# EAGLE design FabDisPendant (EAGLE 7.4.0)
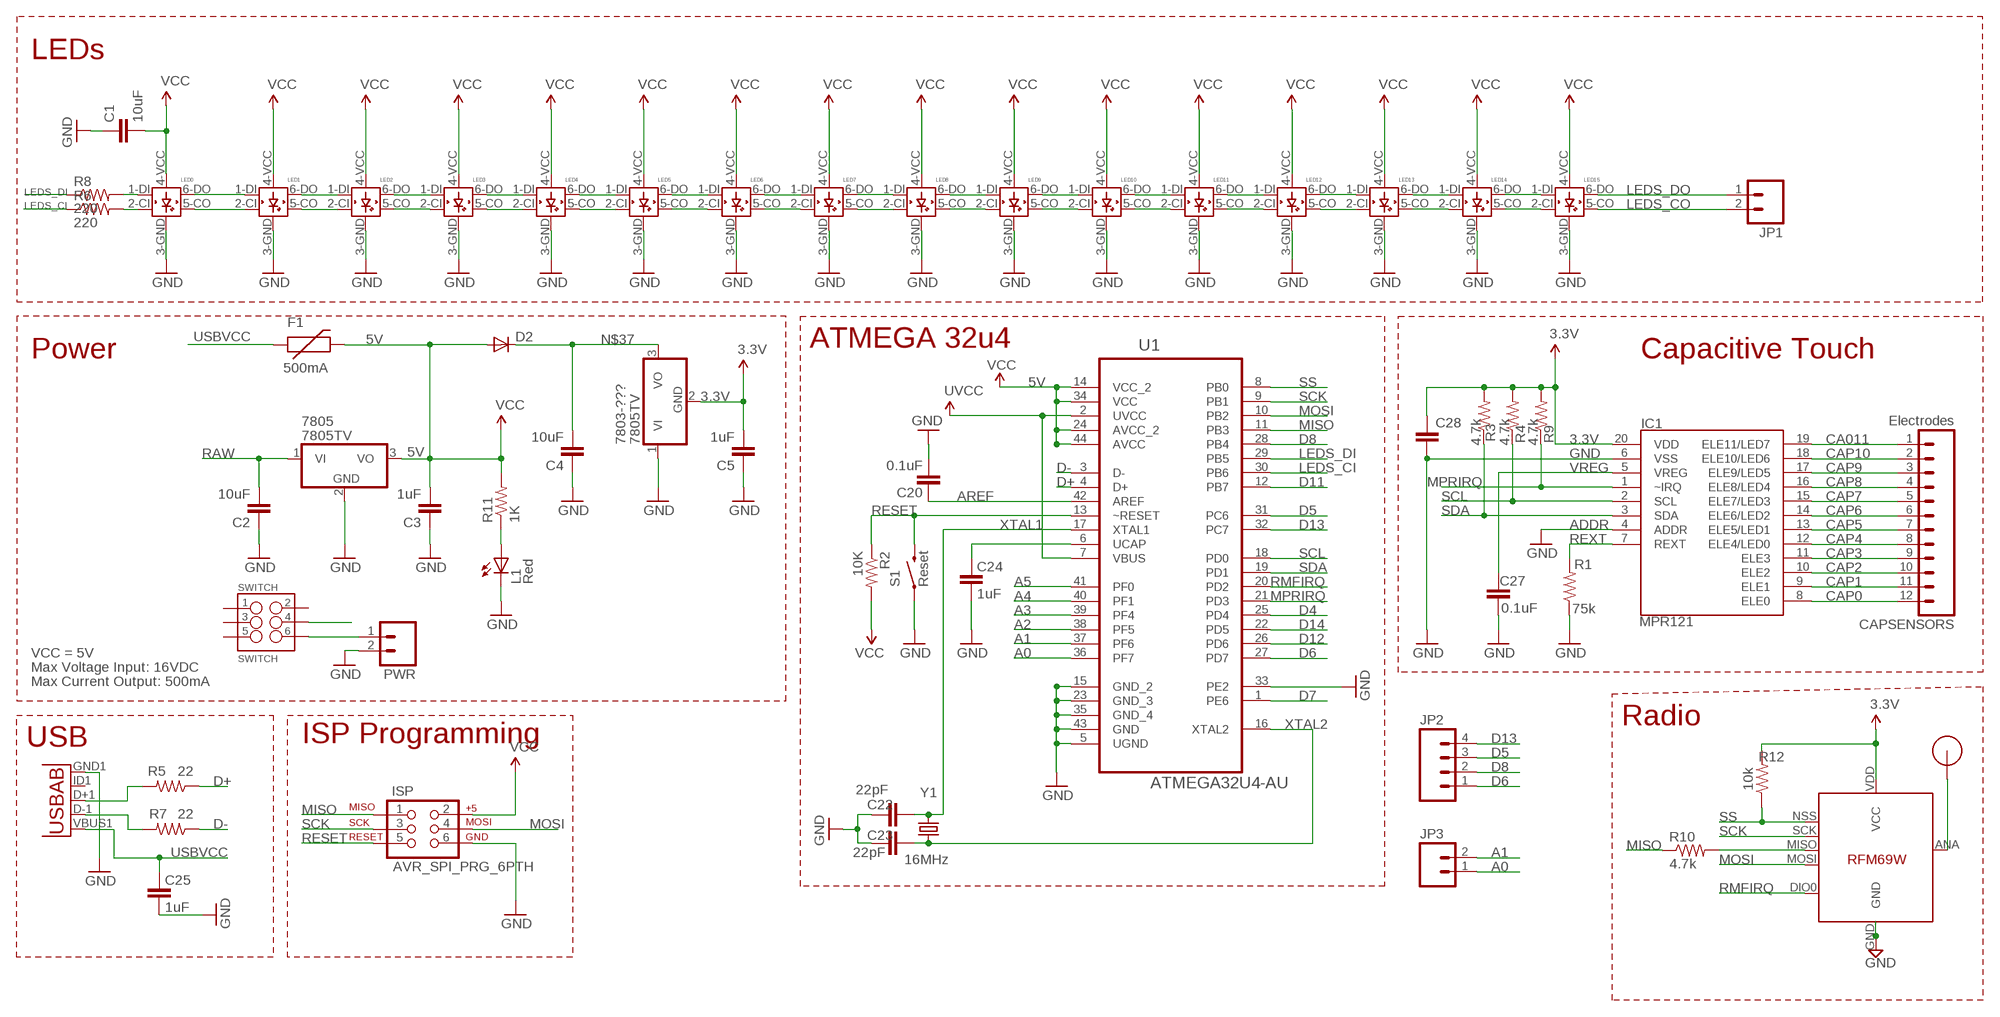
[diagram p0: schematic, sheet 1]

## Parts
7803-???  7805TV  [TO220V]
7805  7805TV  [TO220V]
C1  10uF  10UF-6.3V-20%(1206)  [1206]
C2  10uF  10UF-6.3V-20%(1206)  [1206]
C3  1uF  10UF-6.3V-20%(1206)  [1206]
C4  10uF  10UF-6.3V-20%(1206)  [1206]
C5  1uF  10UF-6.3V-20%(1206)  [1206]
C20  0.1uF  CAP0603-CAP  [0603-CAP]
C22  22pF  CAP0603-CAP  [0603-CAP]
C23  22pF  CAP0603-CAP  [0603-CAP]
C24  1uF  CAP0603-CAP  [0603-CAP]
C25  1uF  CAP0603-CAP  [0603-CAP]
C27  0.1uF  CAP0603-CAP  [0603-CAP]
C28  0.1uF  CAP0603-CAP  [0603-CAP]
CAPSENSORS  Electrodes  M12PTH  [1X12]
D2  DIODESOD  [SOD-323]
F1  500mA  PTCSMD  [PTC-1206]
IC1  MPR121  MPR121V2  [QFN-20-0.4MM-V2]
ISP  AVR_SPI_PRG_6PTH  [2X3]
JP1  M02PTH  [1X02]
JP2  M04PTH  [1X04]
JP3  M02PTH  [1X02]
L1  Red  LED0603  [LED-0603]
LED0  APA102  [5050]
LED1  APA102  [5050]
LED2  APA102  [5050]
LED3  APA102  [5050]
LED4  APA102  [5050]
LED5  APA102  [5050]
LED6  APA102  [5050]
LED7  APA102  [5050]
LED8  APA102  [5050]
LED9  APA102  [5050]
LED10  APA102  [5050]
LED11  APA102  [5050]
LED12  APA102  [5050]
LED13  APA102  [5050]
LED14  APA102  [5050]
LED15  APA102  [5050]
PWR  M025MM  [SCREWTERMINAL-5MM-2]
R1  75k  RESISTOR0603-RES  [0603-RES]
R2  10K  RESISTOR0603-RES  [0603-RES]
R3  4.7k  RESISTOR0603-RES  [0603-RES]
R4  4.7k  RESISTOR0603-RES  [0603-RES]
R5  22  RESISTOR0603-RES  [0603-RES]
R6  220  220OHM-1/10W-1%(0603)  [0603-RES@1]
R7  22  RESISTOR0603-RES  [0603-RES]
R8  220  220OHM-1/10W-1%(0603)  [0603-RES@1]
R9  4.7k  RESISTOR0603-RES  [0603-RES]
R10  4.7k  RESISTOR0603-RES  [0603-RES]
R11  1K  RESISTOR0603-RES  [0603-RES]
R12  10k  RESISTOR0603-RES  [0603-RES]
RMF69  RFM69  [RFM69W-MINPADS]
S1  Reset  SWITCH-MOMENTARY-2SMD  [TACTILE_SWITCH_SMD]
SWITCH  SWITCH  M03X2FEMALE  [2X3]
U1  ATMEGA32U4-AU  [QFP80P1200X1200X120-44N]
U$1  RFM12B_ANTENNA  [RFM12B-ANTENNA]
X2  USB-ABIN&OUT  [USB-AB-MICRO-SMD-V03-IN&OUT]
Y1  16MHz  CRYSTAL5X3  [CRYSTAL-SMD-5X3]

## Nets
3.3V: 7803-???.2(GND) C5.2 C28.1 IC1.20(VDD) R3.2 R4.2 R9.2 R12.2 RMF69.VDD(VCC)
5V: 7805.3(VO) C1.2 C3.2 D2.2(A) F1.2 ISP.2 LED0.4-VCC(VCC) R2.2 R11.2 U1.14(VCC_2) U1.24(AVCC_2) U1.34(VCC) U1.44(AVCC) ; supply symbol labelled VCC
.: R10.2 RMF69.MISO
A0: JP3.1 U1.36(PF7)
A1: JP3.2 U1.37(PF6)
A2: U1.38(PF5)
A3: U1.39(PF4)
A4: U1.40(PF1)
A5: U1.41(PF0)
ADDR: IC1.4(ADDR) ; supply symbol labelled GND
AREF: C20.2 U1.42(AREF)
CA011: CAPSENSORS.1 IC1.19(ELE11/LED7)
CAP0: CAPSENSORS.12 IC1.8(ELE0)
CAP1: CAPSENSORS.11 IC1.9(ELE1)
CAP2: CAPSENSORS.10 IC1.10(ELE2)
CAP3: CAPSENSORS.9 IC1.11(ELE3)
CAP4: CAPSENSORS.8 IC1.12(ELE4/LED0)
CAP5: CAPSENSORS.7 IC1.13(ELE5/LED1)
CAP6: CAPSENSORS.6 IC1.14(ELE6/LED2)
CAP7: CAPSENSORS.5 IC1.15(ELE7/LED3)
CAP8: CAPSENSORS.4 IC1.16(ELE8/LED4)
CAP9: CAPSENSORS.3 IC1.17(ELE9/LED5)
CAP10: CAPSENSORS.2 IC1.18(ELE10/LED6)
D4: U1.25(PD4)
D5: JP2.3 U1.31(PC6)
D6: JP2.1 U1.27(PD7)
D7: U1.1(PE6)
D8: JP2.2 U1.28(PB4)
D11: U1.12(PB7)
D12: U1.26(PD6)
D13: JP2.4 U1.32(PC7)
D14: U1.22(PD5)
D+: R5.1 U1.4(D+)
D-: R7.1 U1.3(D-)
GND: 7803-???.1(VI) 7805.2(GND) C1.1 C2.1 C3.1 C4.1 C5.1 C20.1 C22.2 C23.2 C24.1 C25.1 C27.2 C28.2 IC1.6(VSS) ISP.6 L1.C LED0.3-GND(GND) LED1.3-GND(GND) LED2.3-GND(GND) LED3.3-GND(GND) LED4.3-GND(GND) LED5.3-GND(GND) LED6.3-GND(GND) LED7.3-GND(GND) LED8.3-GND(GND) LED9.3-GND(GND) LED10.3-GND(GND) LED11.3-GND(GND) LED12.3-GND(GND) LED13.3-GND(GND) LED14.3-GND(GND) LED15.3-GND(GND) PWR.2 R1.1 RMF69.GND S1.1 U1.5(UGND) U1.15(GND_2) U1.23(GND_3) U1.33(PE2) U1.35(GND_4) U1.43(GND) X2.GND1(GND)
LEDS_CI: R6.1 U1.30(PB6)
LEDS_CO: JP1.2 LED15.5-CO(CO)
LEDS_DI: R8.1 U1.29(PB5)
LEDS_DO: JP1.1 LED15.6-DO(DO)
MISO: ISP.1 R10.1 U1.11(PB3)
MOSI: ISP.4 RMF69.MOSI U1.10(PB2)
MPRIRQ: IC1.1(~IRQ) R9.1 U1.21(PD3)
N$1: LED0.1-DI(DI) R8.2
N$2: LED0.6-DO(DO) LED1.1-DI(DI)
N$3: LED0.2-CI(CI) R6.2
N$4: LED0.5-CO(CO) LED1.2-CI(CI)
N$5: LED1.6-DO(DO) LED2.1-DI(DI)
N$6: LED1.5-CO(CO) LED2.2-CI(CI)
N$7: LED2.6-DO(DO) LED3.1-DI(DI)
N$8: LED2.5-CO(CO) LED3.2-CI(CI)
N$9: LED3.5-CO(CO) LED4.2-CI(CI)
N$10: LED3.6-DO(DO) LED4.1-DI(DI)
N$11: LED4.6-DO(DO) LED5.1-DI(DI)
N$12: LED4.5-CO(CO) LED5.2-CI(CI)
N$13: LED5.6-DO(DO) LED6.1-DI(DI)
N$14: LED5.5-CO(CO) LED6.2-CI(CI)
N$15: LED6.6-DO(DO) LED7.1-DI(DI)
N$16: LED6.5-CO(CO) LED7.2-CI(CI)
N$17: LED7.5-CO(CO) LED8.2-CI(CI)
N$18: LED7.6-DO(DO) LED8.1-DI(DI)
N$19: LED8.6-DO(DO) LED9.1-DI(DI)
N$20: R7.2 X2.D-1(D-)
N$21: R5.2 X2.D+1(D+)
N$22: LED8.5-CO(CO) LED9.2-CI(CI)
N$23: LED9.6-DO(DO) LED10.1-DI(DI)
N$24: LED9.5-CO(CO) LED10.2-CI(CI)
N$25: RMF69.ANA(ANT) U$1.P$1
N$26: LED10.6-DO(DO) LED11.1-DI(DI)
N$27: LED10.5-CO(CO) LED11.2-CI(CI)
N$28: LED11.6-DO(DO) LED12.1-DI(DI)
N$29: LED11.5-CO(CO) LED12.2-CI(CI)
N$30: LED12.6-DO(DO) LED13.1-DI(DI)
N$31: LED12.5-CO(CO) LED13.2-CI(CI)
N$32: LED13.6-DO(DO) LED14.1-DI(DI)
N$33: LED13.5-CO(CO) LED14.2-CI(CI)
N$34: LED14.6-DO(DO) LED15.1-DI(DI)
N$35: LED14.5-CO(CO) LED15.2-CI(CI)
N$36: PWR.1 SWITCH.6
N$37: 7803-???.3(VO) C4.2 D2.1(C)
N$38: L1.A R11.1
N$55: C24.2 U1.6(UCAP)
RAW [vcc]: 7805.1(VI) C2.2 SWITCH.4
RESET: ISP.5 R2.1 S1.3 U1.13(~RESET)
REXT: IC1.7(REXT) R1.2
RMFIRQ: RMF69.DIO0 U1.20(PD2)
SCK: ISP.3 RMF69.SCK U1.9(PB1)
SCL: IC1.2(SCL) R4.1 U1.18(PD0)
SDA: IC1.3(SDA) R3.1 U1.19(PD1)
SS: R12.1 RMF69.NSS(SEL) U1.8(PB0)
USBVCC: C25.2 F1.1 U1.2(UVCC) U1.7(VBUS) X2.VBUS1(VBUS) ; supply symbol labelled UVCC
VCC: LED1.4-VCC(VCC) LED2.4-VCC(VCC) LED3.4-VCC(VCC) LED4.4-VCC(VCC) LED5.4-VCC(VCC) LED6.4-VCC(VCC) LED7.4-VCC(VCC) LED8.4-VCC(VCC) LED9.4-VCC(VCC) LED10.4-VCC(VCC) LED11.4-VCC(VCC) LED12.4-VCC(VCC) LED13.4-VCC(VCC) LED14.4-VCC(VCC) LED15.4-VCC(VCC)
VREG: C27.1 IC1.5(VREG)
XTAL1: C22.1 U1.17(XTAL1) Y1.3
XTAL2: C23.1 U1.16(XTAL2) Y1.1
Unconnected: SWITCH.1 SWITCH.2 SWITCH.3 SWITCH.5 X2.ID1(USBID)

## Notes on the sheet
- LEDs
- ATMEGA 32u4
- Power | Capacitive Touch
- VCC = 5V
- Max Voltage Input: 16VDC
- Max Current Output: 500mA
- Radio
- USB | ISP Programming

## Library data of the parts
7803-??? 7805 = linear:78*: Positive VOLTAGE REGULATOR Source: http://cache.national.com/ds/LM/LM78L05.pdf http://www.fairchildsemi.com/ds/LM/LM7805.pdf
C1 C2 C4 = SparkFun-Capacitors:10UF-6.3V-20%(1206): CAP-10057 Ceramic; PROD_ID: CAP-10057
C3 C5 = SparkFun-Capacitors:10UF-6.3V-20%(1206): CAP-10057 Ceramic; PROD_ID: CAP-10057; VALUE: 10uF
C20 C22-C25 C27 C28 = SparkFun:CAP: Capacitor Standard 0603 ceramic capacitor, and 0.1" leaded capacitor.
CAPSENSORS = SparkFun:M12: Header 12 Standard 12-pin 0.1" header. Use with straight break away headers (SKU : PRT-00116), right angle break away headers (PRT-00553), swiss pins (PRT-00743), machine pins (PRT-00117), and female headers (PRT-00115).
D2 = SparkFun:DIODE: Diode These are standard reverse protection diodes and small signal diodes. SMA package can handle up to about 1A. SOD-323 can handle about 200mA. What the SOD-323 package when ordering, there are some mfgs out there that are 5-pin packages.
F1 = SparkFun:PTC: Resettable Fuse PTC Resettable Fuse. Spark Fun Electronics SKU : COM-08357
IC1 = Testing:MPR121: MPR121 Capacitive Touch Sensor Controller. Variant "V2" was created using an image import of the bottom of the IC. It matches metal to metal.
ISP = SparkFun-Connectors:AVR_SPI_PRG_6: AVR ISP 6 Pin This is the reduced ISP connector for AVR programming. Common on Arduino. This footprint will take up less PCB space and can be used with a 10-pin to 6-pin adapter such as SKU: BOB-08508
JP1 JP3 = SparkFun-Connectors:M02: Standard 2-pin 0.1" header. Use with - straight break away headers ( PRT-00116) - right angle break away headers (PRT-00553) - swiss pins (PRT-00743) - machine pins (PRT-00117) - female headers (PRT-00115) Molex polarized connector foot print use with: PRT-08233 with associated crimp pins and housings. 2.54_SCREWTERM for use with PRT-10571. 3.5mm Screw Terminal footprints for PRT-08084 5mm Screw Terminal footprints for use with PRT-08432
JP2 = SparkFun-Connectors:M04: Header 4 Standard 4-pin 0.1" header. Use with straight break away headers (SKU : PRT-00116), right angle break away headers (PRT-00553), swiss pins (PRT-00743), machine pins (PRT-00117), and female headers (PRT-00115). Molex polarized connector foot print use with SKU : PRT-08231 with associated crimp pins and housings. 1MM SMD Version SKU: PRT-10208
L1 = SparkFun:LED: LEDs Standard schematic elements and footprints for 5mm, 3mm, 1206, and 0603 sized LEDs. 5mm - Spark Fun Electronics SKU : COM-00529 (and others)
LED0 LED1-LED15 = APA102:APA102: APA102C LED Specsheet <https://cdn-shop.adafruit.com/datasheets/APA102.pdf> Blog post <https://cpldcpu.wordpress.com/2014/08/27/apa102/> Adafruit <https://www.adafruit.com/products/2343>
PWR = SparkFun-Connectors:M02: Standard 2-pin 0.1" header. Use with - straight break away headers ( PRT-00116) - right angle break away headers (PRT-00553) - swiss pins (PRT-00743) - machine pins (PRT-00117) - female headers (PRT-00115) Molex polarized connector foot print use with: PRT-08233 with associated crimp pins and housings. 2.54_SCREWTERM for use with PRT-10571. 3.5mm Screw Terminal footprints for PRT-08084 5mm Screw Terminal footprints for use with PRT-08432; STOREFRONT_ID: PRT-08432
R1-R5 R7 R9-R12 = SparkFun:RESISTOR: Resistor Basic schematic elements and footprints for 0603, 1206, and PTH 1/10th watt (small) resistors.
R6 R8 = SparkFun-Resistors:220OHM-1/10W-1%(0603): RES-07861; PROD_ID: RES-07861
RMF69 = LowPowerLab:RFM69
S1 = SparkFun:SWITCH-MOMENTARY-2
SWITCH = SparkFun-Connectors:M03X2: 2x3 .1" header. Shrouded, with keying- CONN-10681 SMT- CONN-11415 Pogo pins- HW-11044; PROD_ID: CONN-11566; VALUE: FEMALE 2x3
U1 = Atmel_By_element14_Batch_1-00:ATMEGA32U4-AU: 8-bit Microcontroller with ISP Flash and USB Controller; MPN: ATMEGA32U4-AU; OC_FARNELL: 1748525; OC_NEWARK: 26R5633; PACKAGE: TQFP-44; SUPPLIER: Atmel
U$1 = LowPowerLab:RFM12B_ANTENNA
X2 = Testing:USB-AB: This is a USB AB connector that is compatible with USB OTG. i.e. this connector can serve as a host or device
Y1 = SparkFun:CRYSTAL: Crystals Various standard crystals. Proven footprints. Spark Fun Electronics SKU : COM-00534

## Net classes
0 default: width 0.203 mm

## Board
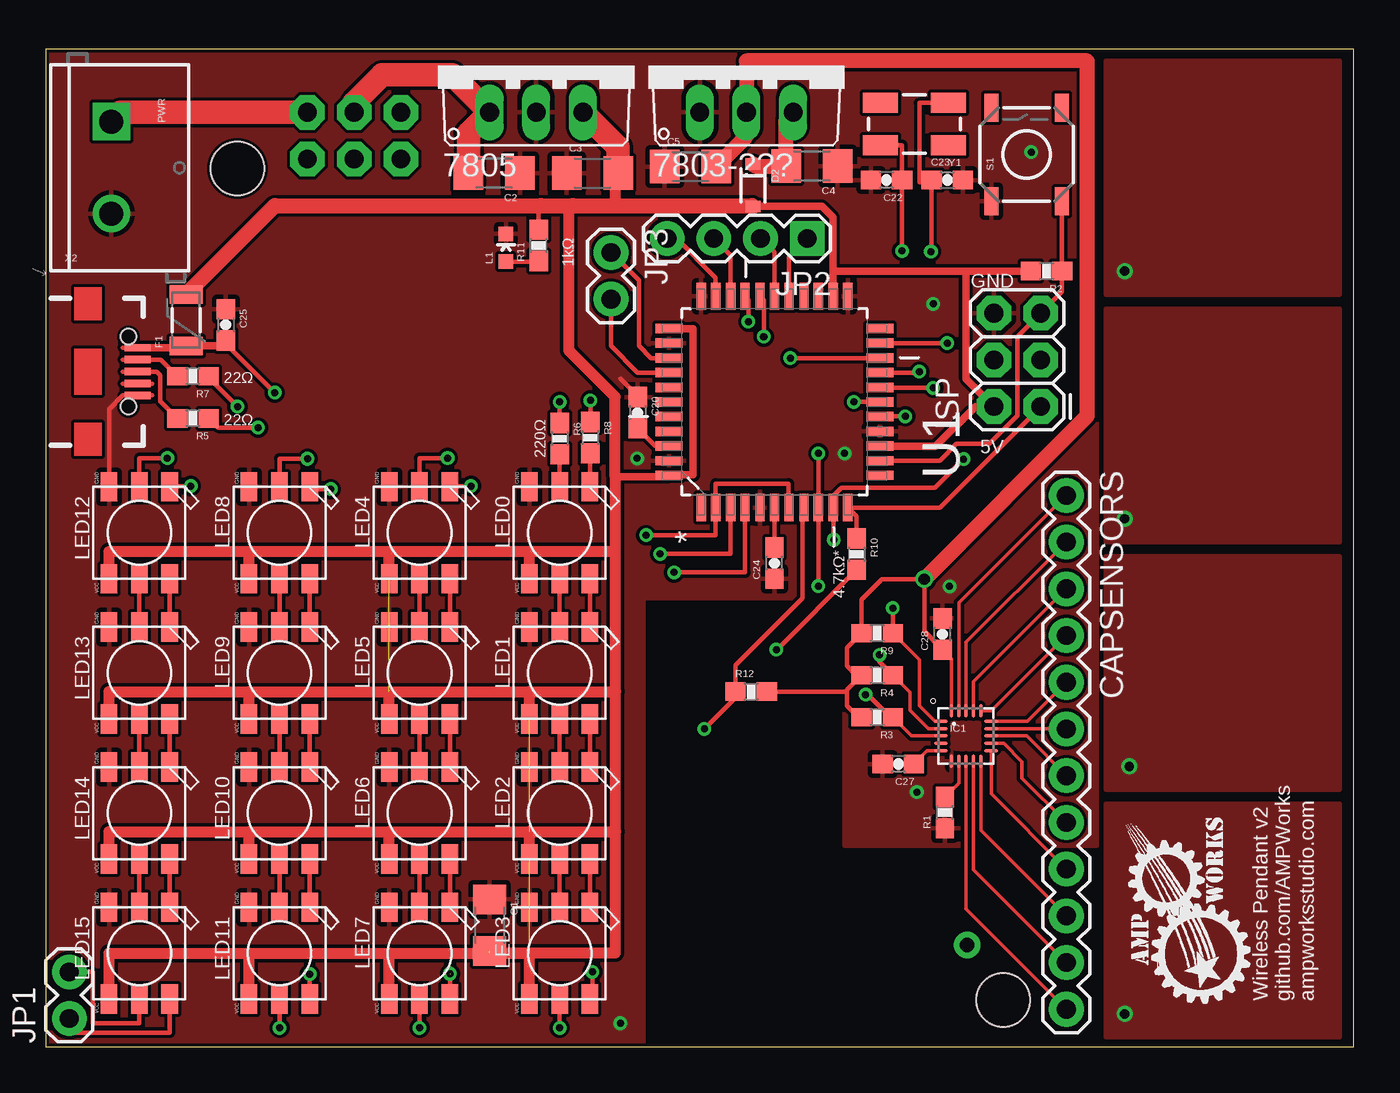
[diagram p1: board, top side]
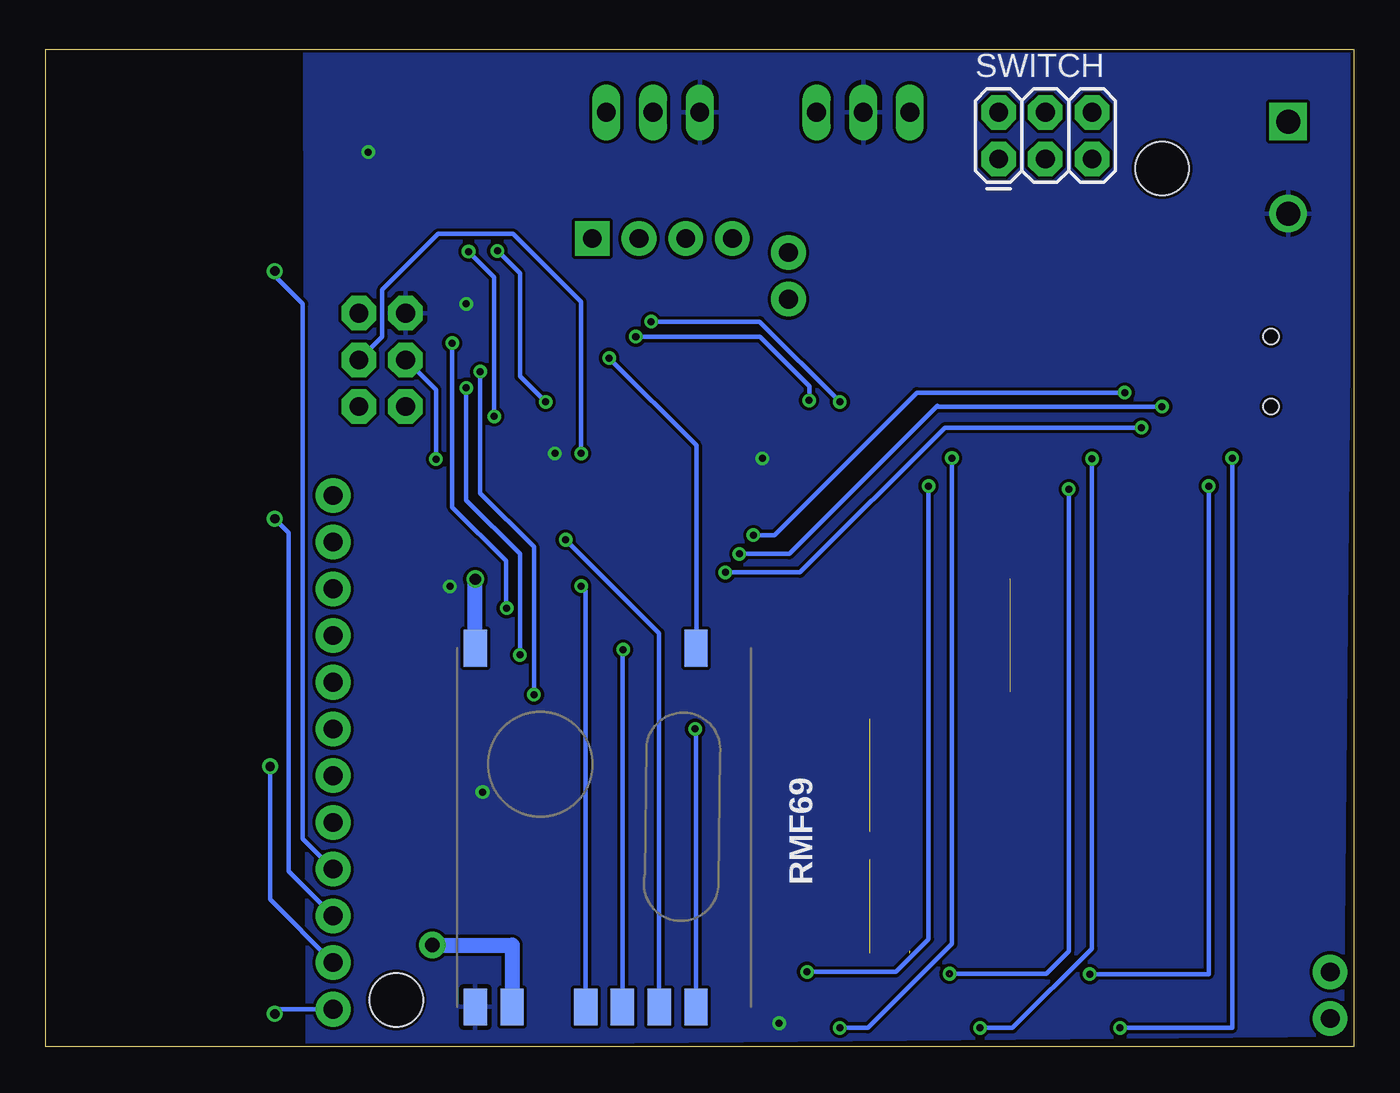
[diagram p2: board, bottom side, seen from below]

Size 71.12 x 54.22 mm. Coordinates in mm from the lower left corner, seen from the top.
Outline: 0,0 71.12,0 71.12,54.22 0,54.22 0,0
Copper layers (1*16): Top 0.035mm / dielectric 1.5mm / Bottom 0.035mm
Design rules "SparkFun-2-layer-TIGHT": minimum track width 7mil, minimum drill 15mil, track to track 7mil, track to pad 7mil, pad to pad 7mil, via to via 7mil, smd to smd 7mil, copper to edge 7mil, drill to drill 7mil, minimum pad ring 7mil, minimum via ring 7mil, stop-mask expansion 4mil, vias tented up to drill 20mil, thermal gap 10mil
Holes 2.92 mm at 10.41,47.75 52.07,2.54

### Footprints (pad centres in the part's own frame; a part is rotated, then mirrored left to right if it is on the bottom)
TO220V = drill 1.016 long: 1 -2.54,-2.54; 2 0,-2.54; 3 2.54,-2.54
1206 = smd 1.6 x 1.8: 1 -1.4,0; 2 1.4,0
0603-CAP = smd 1.1 x 1: 1 -0.85,0; 2 0.85,0
1X12 = drill 1.016 pad 1.88: 1 0,0; 2 2.54,0; 3 5.08,0; 4 7.62,0; 5 10.16,0; 6 12.7,0; 7 15.24,0; 8 17.78,0; 9 20.32,0; 10 22.86,0; 11 25.4,0; 12 27.94,0
SOD-323 = smd 0.63 x 0.83: 1 -1.15,0; 2 1.15,0
PTC-1206 = smd 1 x 1.8: 1 -1.4,0; 2 1.4,0
QFN-20-0.4MM-V2 = smd 0.75 x 0.195: 1 -1.367,0.8; 2 -1.367,0.4; 3 -1.367,0; 4 -1.367,-0.4; 5 -1.367,-0.8; 11 1.375,-0.8; 12 1.375,-0.4; 13 1.375,0; 14 1.375,0.4; 15 1.375,0.8 | smd 0.195 x 0.75: 6 -0.795,-1.372; 7 -0.395,-1.372; 8 0.005,-1.372; 9 0.405,-1.372; 10 0.805,-1.372; 16 0.81,1.372; 17 0.41,1.372; 18 0.01,1.372; 19 -0.39,1.372; 20 -0.79,1.372
2X3 = drill 1.016 pad 1.88 octagon: 1 0,0; 2 0,2.54; 3 2.54,0; 4 2.54,2.54; 5 5.08,0; 6 5.08,2.54
1X02 = drill 1.016 pad 1.88: 1 0,0; 2 2.54,0
1X04 = drill 1.016 pad 1.88 square: 1 0,0 | drill 1.016 pad 1.88: 2 2.54,0; 3 5.08,0; 4 7.62,0
LED-0603 = smd 0.8 x 0.8: A 0,-0.75; C 0,0.75
5050 = smd 1.6 x 0.9: 1-DI -2.5,1.65; 2-CI -2.5,0; 3-GND -2.5,-1.65; 4-VCC 2.5,-1.65; 5-CO 2.5,0; 6-DO 2.5,1.65
SCREWTERMINAL-5MM-2 = drill 1.3 pad 2.032 square: 1 0,0 | drill 1.3 pad 2.032: 2 5,0
0603-RES = smd 1.1 x 1: 1 -0.85,0; 2 0.85,0
0603-RES@1 = smd 1.1 x 1: 1 -0.85,0; 2 0.85,0
RFM69W-MINPADS = smd 2 x 1.27: ANA 8,-5; DIO0 -11.5,5; GND 8,-7; MISO 8,1; MOSI 8,3; NSS 8,5; SCK 8,-1; VDD -11.5,-7
TACTILE_SWITCH_SMD = smd 1.524 x 0.762: 1 -2.54,1.905; 2 2.54,1.905; 3 -2.54,-1.905; 4 2.54,-1.905
QFP80P1200X1200X120-44N = smd 1.473 x 0.508: 1 -5.74,3.988; 2 -5.74,3.2; 3 -5.74,2.388; 4 -5.74,1.6; 5 -5.74,0.787; 6 -5.74,0; 7 -5.74,-0.787; 8 -5.74,-1.6; 9 -5.74,-2.388; 10 -5.74,-3.2; 11 -5.74,-3.988; 23 5.74,-3.988; 24 5.74,-3.2; 25 5.74,-2.388; 26 5.74,-1.6; 27 5.74,-0.787; 28 5.74,0; 29 5.74,0.787; 30 5.74,1.6; 31 5.74,2.388; 32 5.74,3.2; 33 5.74,3.988 | smd 0.508 x 1.473: 12 -3.988,-5.74; 13 -3.2,-5.74; 14 -2.388,-5.74; 15 -1.6,-5.74; 16 -0.787,-5.74; 17 0,-5.74; 18 0.787,-5.74; 19 1.6,-5.74; 20 2.388,-5.74; 21 3.2,-5.74; 22 3.988,-5.74; 34 3.988,5.74; 35 3.2,5.74; 36 2.388,5.74; 37 1.6,5.74; 38 0.787,5.74; 39 0,5.74; 40 -0.787,5.74; 41 -1.6,5.74; 42 -2.388,5.74; 43 -3.2,5.74; 44 -3.988,5.74
RFM12B-ANTENNA = drill 0.8 pad 1.422: P$1 0,0
USB-AB-MICRO-SMD-V03-IN&OUT = smd 1.4 x 0.4: D+1 2.7,0; D-1 2.7,0.65; GND1 2.7,-1.3; ID1 2.7,-0.65; VBUS1 2.7,1.3 | hole 0.85: 2.2,1.9; 2.2,-1.9
CRYSTAL-SMD-5X3 = smd 1.9 x 1.1: 1 -1.85,-1.15; 2 1.85,-1.15; 3 1.85,1.15; 4 -1.85,1.15

### Placement (x,y rotation side)
7803-???  38.1,53.34 0 top
7805  26.67,53.34 0 top
C1  24.13,6.6 270 top
C2  24.38,47.5 180 top
C3  29.72,47.5 0 top
C4  41.66,47.88 180 top
C5  35.05,47.85 0 top
C20  32.18,34.47 270 top
C22  45.72,47.12 180 top
C23  49.02,47.12 0 top
C24  39.62,26.29 90 top
C25  9.78,39.24 270 top
C27  46.35,15.37 180 top
C28  48.77,22.43 90 top
CAPSENSORS  55.5,29.97 270 top
D2  38.46,46.84 270 top
F1  7.62,39.5 90 top
IC1  50.04,16.89 0 top
ISP  54.1,34.8 90 top
JP1  1.27,1.52 90 top
JP2  41.4,43.94 180 top
JP3  30.73,43.18 270 top
L1  25.02,43.43 0 top
LED0  27.94,27.94 270 top
LED1  27.94,20.32 270 top
LED2  27.94,12.7 270 top
LED3  27.94,5.08 270 top
LED4  20.32,27.94 270 top
LED5  20.32,20.32 270 top
LED6  20.32,12.7 270 top
LED7  20.32,5.08 270 top
LED8  12.7,27.94 270 top
LED9  12.7,20.32 270 top
LED10  12.7,12.7 270 top
LED11  12.7,5.08 270 top
LED12  5.08,27.94 270 top
LED13  5.08,20.32 270 top
LED14  5.08,12.7 270 top
LED15  5.08,5.08 270 top
PWR  3.56,50.29 270 top
R1  48.9,12.73 90 top
R2  54.42,42.16 180 top
R3  45.21,17.91 180 top
R4  45.21,20.19 180 top
R5  8,34.16 180 top
R6  27.94,33.06 270 top
R7  8,36.45 180 top
R8  29.6,33.11 270 top
R9  45.21,22.48 180 top
R10  44.09,26.77 270 top
R11  26.8,43.56 90 top
R12  38.35,19.3 0 top
RMF69  40.77,10.16 270 bottom
S1  53.34,48.51 90 top
SWITCH  19.3,48.26 0 bottom
U1  39.62,35.05 90 top
U$1  50.1,5.52 0 top
X2  2.29,36.7 0 top
Y1  47.24,50.16 180 top

### Tracks (layer width: path | path; a pad name or v marks a point on that pad's centre or on a via)
3.3V  (via drill 0.6)
  Top 0.203: IC1.20 49.25,21.1 C28.1
  Top 0.254: C28.1 47.77,22.58 v47.77,25.41 47.75,25.4 45.47,25.4 44.36,24.3 R9.2 43.56,21.68 43.56,20.7 44.07,20.19 R4.2 43.56,19.39 43.56,19.3 | 43.56,19.3 43.56,18.54 44.2,17.91 R3.2 | R12.2 43.56,19.3
  Top 0.813: v47.77,25.41 56.64,34.29 56.64,53.59 38.1,53.59 7803-???.2 38.1,49.5 C5.2
  Bottom 0.813: RMF69.VDD v47.77,25.41
5V  (1 unrouted)
  Top 0.254: R11.2 26.8,45.59 26.92,45.72
  Top 0.406: U1.14 45.34,32.64 48.39,32.64 50.55,34.8 ISP.2 50.04,36.32 50.04,42.16 | U1.24 42.8,40.82 42.8,42.16 | 30.96,30.99 33.81,30.99 U1.44 33.88,31.09 35.2,31.09 35.2,39.04 U1.34 | R2.2 50.04,42.16 | 50.04,42.16 42.8,42.16 | 42.8,42.16 42.8,45.09 42.2,45.69 D2.2
  Top 0.61: C3.2 30.96,47.5 30.96,45.72 | 30.96,26.92 30.96,30.99 30.96,35.33 28.45,37.85 28.45,45.52 28.65,45.72 | 30.96,26.92 30.96,5.08 24.13,5.08 | LED0.4-VCC 26.29,26.92 30.96,26.92
  Top 0.813: F1.2 12.44,45.72 26.92,45.72 28.65,45.72 30.96,45.72 38.42,45.72 D2.2
  Top 1.27: 7805.3 31.12,48.89 C3.2
.  (via drill 0.38)
  Top 0.254: R10.2 39.76,21.59 v39.73,21.59
  Bottom 0.254: v39.73,21.59 39.77,21.55 RMF69.MISO
A0
  Top 0.254: U1.36 32.92,37.44 32.26,38.1 32.26,41.66 JP3.1
A1
  Top 0.254: U1.37 32.18,36.65 30.73,38.1 JP3.2
AREF
  Top 0.254: U1.42 33.13,32.66 C20.2
CA011
  Top 0.203: IC1.19 49.65,24.12 CAPSENSORS.1
CAP0  (via drill 0.51)
  Top 0.203: IC1.8 50.04,7.49 CAPSENSORS.12
  Bottom 0.254: 58.67,2.03 v58.67,1.78 58.42,2.03 CAPSENSORS.12
  pour Top: 57.66,0.51 70.36,0.51 70.36,13.21 57.66,13.21
CAP1  (via drill 0.51)
  Top 0.203: IC1.9 50.44,9.63 CAPSENSORS.11
  Bottom 0.254: CAPSENSORS.11 58.93,8 v58.93,15.24
  pour Top: 57.66,13.97 70.36,13.97 70.36,26.67 57.66,26.67
CAP2  (via drill 0.51)
  Top 0.203: IC1.10 50.84,11.77 CAPSENSORS.10
  Bottom 0.254: CAPSENSORS.10 57.91,9.53 57.91,27.94 v58.67,28.7
  pour Top: 57.66,27.43 70.36,27.43 70.36,40.13 57.66,40.13
CAP3  (via drill 0.51)
  Top 0.203: IC1.11 51.41,13.74 CAPSENSORS.9
  Bottom 0.254: CAPSENSORS.9 57.15,11.3 57.15,40.39 58.67,41.91
  Bottom 0.406: 58.67,41.91 v58.67,42.16
  pour Top: 57.66,40.89 70.36,40.89 70.36,53.59 57.66,53.59
CAP4
  Top 0.203: IC1.12 52.09,16.49 53.09,15.49 53.09,14.61 CAPSENSORS.8
CAP5
  Top 0.203: IC1.13 53.34,16.89 CAPSENSORS.7
CAP6
  Top 0.203: IC1.14 55.48,17.29 CAPSENSORS.6
CAP7
  Top 0.203: IC1.15 53.38,17.69 CAPSENSORS.5
CAP8
  Top 0.203: IC1.16 51.41,18.26 CAPSENSORS.4
CAP9
  Top 0.203: IC1.17 50.45,19.84 CAPSENSORS.3
CAP10
  Top 0.203: IC1.18 50.05,21.98 CAPSENSORS.2
D5
  Top 0.254: U1.31 37.24,43.03 JP2.3
D6
  Top 0.254: U1.27 40.41,42.95 JP2.1
D8
  Top 0.254: U1.28 39.62,43.18 JP2.2
D13
  Top 0.254: U1.32 36.42,41.81 34.29,43.94 JP2.4
D+  (via drill 0.38)
  Top 0.254: v34.16,25.78 38.02,25.78 U1.4 | R5.1 9.36,33.66 v11.53,33.66
  Bottom 0.254: v34.16,25.78 30.1,25.78 22.23,33.66 v11.53,33.66
D-  (via drill 0.38)
  Top 0.254: v33.4,26.8 37.24,26.8 U1.3 | v10.41,34.8 8.85,36.36 R7.1
  Bottom 0.254: v33.4,26.8 30.68,26.8 22.63,34.85 22.58,34.8 v10.41,34.8
GND  (via drill 0.38)
  Top 0.254: LED12.3-GND 3.43,34.65 4.18,35.4 | C20.1 32.18,35.38 31.24,36.32
  other vias: 53.59,48.64 43.43,32.26 49.15,25.02 31.24,1.27 48.26,40.39 47.37,13.84 32.16,31.98
  pour Bottom: 0.13,54.1 57.02,54.1 56.9,0.13 0.64,0.64
  pour Top: 0,0 32.51,0 32.51,24.38 43.43,24.38 43.43,10.92 57.15,10.92 57.15,54.1 0,54.1
LEDS_CI  (via drill 0.38)
  Top 0.254: v27.94,35.05 R6.1 | v38.2,39.42 38.2,40.62 U1.30
  Bottom 0.254: v38.2,39.42 32.31,39.42 v27.94,35.05
LEDS_CO
  Top 0.254: LED15.5-CO 5.08,1.27 2.54,1.27 2.54,4.06 JP1.2
LEDS_DI  (via drill 0.38)
  Top 0.254: v29.62,35.14 29.62,33.96 R8.1 | v39.04,38.61 39.04,40.59 U1.29
  Bottom 0.254: v39.04,38.61 32.28,38.61 29.59,35.92 29.59,35.16 v29.62,35.14
LEDS_DO
  Top 0.254: LED15.6-DO 6.73,0.76 1.27,0.76 JP1.1
MISO
  Top 0.254: ISP.1 48.62,29.31 U1.11 44.09,28.83 R10.1
MOSI  (via drill 0.38)
  Top 0.254: v49.91,31.94 48.35,30.38 43.26,30.38 42.82,29.95 U1.10 42.82,27.58 v42.85,27.56
  Bottom 0.203: 51.53,37.34 ISP.4
  Bottom 0.254: 51.53,37.34 49.91,35.72 v49.91,31.94 | v42.85,27.56 37.77,22.48 RMF69.MOSI
MPRIRQ  (via drill 0.38)
  Top 0.203: IC1.1 48.35,17.69 47.5,18.54 47.5,21.04 R9.1
  Top 0.254: v49.02,38.25 U1.21 | v46.06,23.84 R9.1
  Bottom 0.254: v49.02,38.25 49.02,29.34 46.1,26.42 46.1,23.88 v46.06,23.84
N$1
  Top 0.254: LED0.1-DI 29.59,32.24 R8.2
N$2
  Top 0.254: LED0.6-DO LED1.1-DI
N$3
  Top 0.254: LED0.2-CI 27.93,30.45 27.93,32.19 R6.2
N$4
  Top 0.254: LED1.2-CI LED0.5-CO
N$5
  Top 0.254: LED1.6-DO LED2.1-DI
N$6
  Top 0.254: LED1.5-CO LED2.2-CI
N$7
  Top 0.254: LED2.6-DO LED3.1-DI
N$8
  Top 0.254: LED2.5-CO LED3.2-CI
N$9  (via drill 0.38)
  Top 0.254: LED3.5-CO v27.94,1.02 | v21.84,32 20.32,32 LED4.2-CI
  Bottom 0.254: v21.84,32 21.84,5.59 26.42,1.02 v27.94,1.02
N$10  (via drill 0.38)
  Top 0.254: LED3.6-DO 29.72,2.71 v29.72,4.06 | v23.11,30.48 21.97,30.48 LED4.1-DI
  Bottom 0.254: v29.72,4.06 24.89,4.06 23.11,5.84 v23.11,30.48
N$11
  Top 0.254: LED4.6-DO LED5.1-DI
N$12
  Top 0.254: LED4.5-CO LED5.2-CI
N$13
  Top 0.254: LED5.6-DO LED6.1-DI
N$14
  Top 0.254: LED5.5-CO LED6.2-CI
N$15
  Top 0.254: LED7.1-DI LED6.6-DO
N$16
  Top 0.254: LED6.5-CO LED7.2-CI
N$17  (via drill 0.38)
  Top 0.254: v14.22,31.96 12.7,31.96 LED8.2-CI | v20.32,1.02 LED7.5-CO
  Bottom 0.254: v20.32,1.02 18.54,1.02 14.22,5.33 v14.22,31.96
N$18  (via drill 0.38)  (1 unrouted)
  Top 0.254: v15.49,30.31 14.35,30.31 LED8.1-DI | 21.97,3.94 21.97,3.9 | v21.97,3.96 LED7.6-DO
  Bottom 0.254: v15.49,30.31 15.49,5.18 16.71,3.96 v21.97,3.96
N$19
  Top 0.254: LED9.1-DI LED8.6-DO
N$20
  Top 0.254: 5.79,37.35 6.25,37.35 R7.2
N$21
  Top 0.254: 5.79,36.7 6.03,36.7 6.22,36.51 6.22,35.09 R5.2
N$22
  Top 0.254: LED8.5-CO LED9.2-CI
N$23
  Top 0.254: LED10.1-DI LED9.6-DO
N$24
  Top 0.254: LED9.5-CO LED10.2-CI
N$25
  Bottom 0.813: U$1.P$1 45.77,5.52 RMF69.ANA
N$26
  Top 0.254: LED10.6-DO LED11.1-DI
N$27
  Top 0.254: LED10.5-CO LED11.2-CI
N$28  (via drill 0.38)
  Top 0.254: v7.87,30.48 6.73,30.48 LED12.1-DI | v14.35,3.94 LED11.6-DO
  Bottom 0.254: v7.87,30.48 7.87,3.94 v14.35,3.94
N$29  (via drill 0.38)
  Top 0.254: v6.6,32 5.08,32 LED12.2-CI | LED11.5-CO v12.7,1.02
  Bottom 0.254: v12.7,1.02 6.6,1.02 v6.6,32
N$30
  Top 0.254: LED13.1-DI LED12.6-DO
N$31
  Top 0.254: LED12.5-CO LED13.2-CI
N$32
  Top 0.254: LED13.6-DO LED14.1-DI
N$33
  Top 0.254: LED14.2-CI LED13.5-CO
N$34
  Top 0.254: LED15.1-DI LED14.6-DO
N$35
  Top 0.254: LED14.5-CO LED15.2-CI
N$36
  Top 1.27: PWR.1 4.06,50.8 SWITCH.6
N$37
  Top 0.813: 39.86,47.48 C4.2 | C4.2 40.26,50.42 7803-???.3 | D2.1 38.56,47.88 C4.2
N$38
  Top 0.254: L1.A 26.77,42.68 R11.1
N$55
  Top 0.254: U1.6 C24.2
RAW
  Top 1.27: C2.2 22.98,49.65 7805.1 22.1,52.83 18.29,52.83 16.76,51.31 SWITCH.4
RESET
  Top 0.254: U1.13 48.62,31.85 49.53,32.77 51.31,32.77 52.83,34.29 52.83,38.61 ISP.5 55.27,41.05 R2.1 55.24,42.19 S1.3
REXT
  Top 0.203: IC1.7 49.64,14.32 R1.2
RMFIRQ  (via drill 0.38)
  Top 0.254: U1.20 v40.49,37.44
  Bottom 0.254: v40.49,37.44 35.74,32.69 35.74,21.69 RMF69.DIO0
SCK  (via drill 0.38)
  Top 0.254: v42.01,32.26 U1.9 v42.01,25.04
  Bottom 0.254: ISP.3 52.83,38.61 52.83,41.15 49.78,44.2 45.72,44.2 42.01,40.49 v42.01,32.26 | v42.01,25.04 41.77,24.8 RMF69.SCK
SCL  (via drill 0.38)
  Top 0.203: IC1.2 47.99,17.29 46.99,18.29 46.99,19.27 R4.1
  Top 0.254: U1.18 45.39,35.81 v48.26,35.81 | R4.1 45.34,20.92 v45.34,21.3
  Bottom 0.254: v48.26,35.81 48.26,29.72 45.34,26.8 v45.34,21.3
SDA  (via drill 0.38)
  Top 0.203: IC1.3 47.08,16.89 R3.1
  Top 0.254: v47.5,36.7 47.45,36.65 U1.19 | R3.1 45.94,17.91 44.7,19.14 v44.58,19.14
  Bottom 0.254: v47.5,36.7 47.5,30.1 44.58,27.18 v44.58,19.14
SS  (via drill 0.38)
  Top 0.254: 41.15,29.23 41.31,29.07 | 35.81,17.36 v35.81,17.27 37.5,18.96 R12.1 37.5,20.74 41.15,24.38 41.15,29.23 | 41.15,29.23 U1.8
  Bottom 0.254: v35.81,17.27 35.77,17.23 RMF69.NSS
USBVCC  (via drill 0.38)
  Top 0.254: U1.2 36.42,30.61 40.39,30.61 40.39,29.31 U1.7 | 9.78,38.35 9.78,38.1 | 36.45,29.29 U1.2 | v32.64,27.81 36.42,27.81 U1.2 | v12.45,35.56 9.78,38.23 C25.2
  Top 0.406: 9.78,38.35 C25.2 9.48,38.1 F1.1 7.53,38 X2.VBUS1
  Bottom 0.254: v32.64,27.81 31.5,27.81 23.75,35.56 v12.45,35.56
VCC  (3 unrouted)
  Top 0.61: LED3.4-VCC 26.29,5.08 18.67,5.08 | LED7.4-VCC 18.67,5.08 | LED11.4-VCC 11.05,5.08 | 11.05,5.08 18.67,5.08 | LED15.4-VCC 3.43,5.08 11.05,5.08 | LED2.4-VCC 26.29,11.68 | 26.29,11.68 30.99,11.68 | LED6.4-VCC 18.67,11.68 | 18.67,11.68 26.29,11.68 | LED10.4-VCC 11.05,11.68 | 11.05,11.68 18.67,11.68 | LED14.4-VCC 3.43,11.68 11.05,11.68 | LED1.4-VCC 26.29,19.3 | 26.29,19.3 30.99,19.3 | LED5.4-VCC 18.67,19.3 | 18.67,19.3 26.29,19.3 | LED9.4-VCC 11.05,19.3 | 11.05,19.3 18.67,19.3 | LED13.4-VCC 3.43,19.3 11.05,19.3 | LED4.4-VCC 18.67,26.92 | 18.67,26.92 26.42,26.92 | LED8.4-VCC 11.05,26.92 | 11.05,26.92 18.67,26.92 | LED12.4-VCC 3.43,26.92 11.05,26.92
VREG
  Top 0.203: IC1.5 47.93,16.09 C27.1
XTAL1  (via drill 0.38)
  Top 0.254: Y1.3 46.57,49.02 C22.1 v46.57,43.27 | v43.94,35.05 U1.17
  Bottom 0.254: v43.94,35.05 45.34,36.45 45.34,42.04 v46.57,43.27
XTAL2  (via drill 0.38)
  Top 0.254: v46.74,34.27 U1.16 | 48.17,46.95 C23.1 | Y1.1 47.5,51.31 47.5,46.99 48.17,46.99 C23.1 | v48.13,43.23 48.17,43.23 C23.1
  Bottom 0.254: v46.74,34.27 46.74,41.83 v48.13,43.23

### Text on the board
tPlace: 1kΩ | GND | 22Ω | 22Ω | 220Ω | 5V | 4.7kΩ* | Wireless Pendant v2 | github.com/AMPWorks | ampworksstudio.com